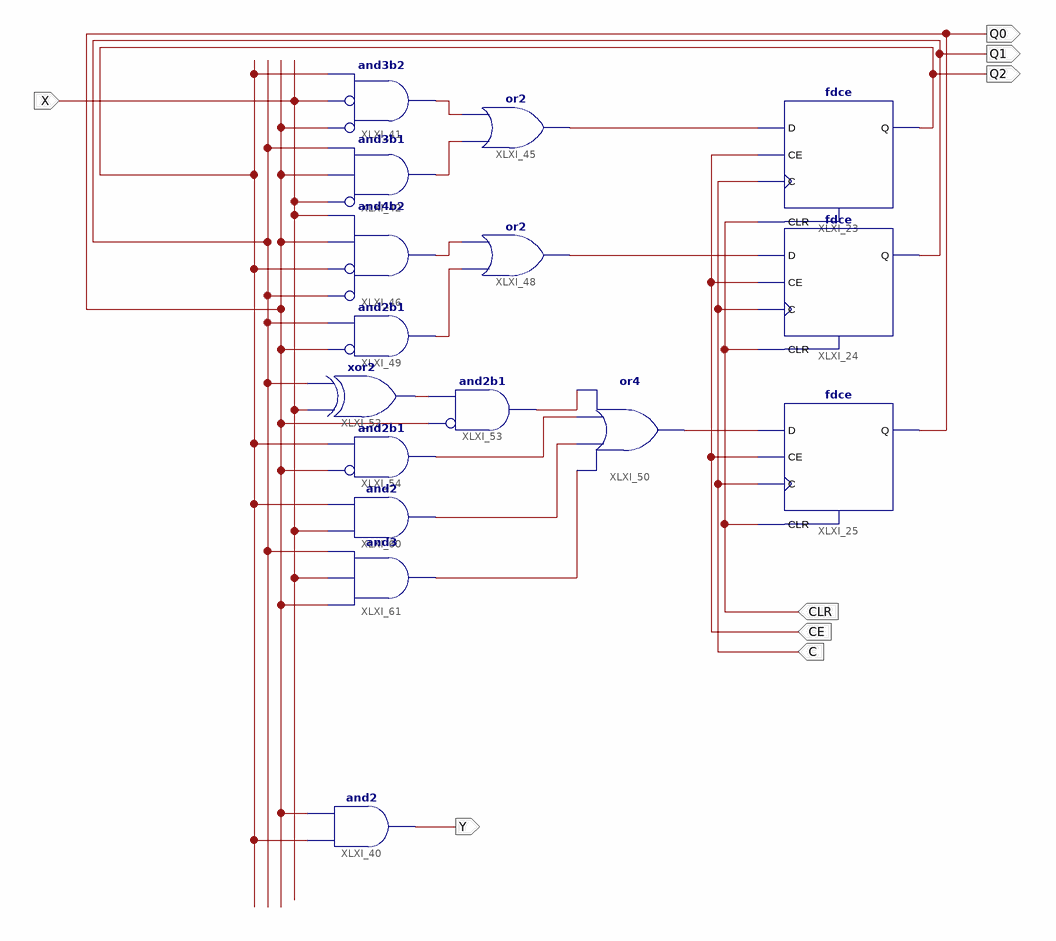
[diagram p0: schematic sheet 1]
// Xilinx ISE schematic lab4.sch (xc9500xl) as structural Verilog: 16 symbols, 8 ports
module lab4 (
  input  X,
  input  CLR,
  input  CE,
  input  C,
  output Q2,
  output Q0,
  output Q1,
  output Y
);

  wire XLXN_53, XLXN_54, XLXN_55, XLXN_100, XLXN_101, XLXN_102, XLXN_103, XLXN_104, XLXN_105, XLXN_116,
       XLXN_117, XLXN_118;

  fdce XLXI_23 (.C(C), .CE(CE), .CLR(CLR), .D(XLXN_53), .Q(Q2));
  fdce XLXI_24 (.C(C), .CE(CE), .CLR(CLR), .D(XLXN_54), .Q(Q1));
  fdce XLXI_25 (.C(C), .CE(CE), .CLR(CLR), .D(XLXN_55), .Q(Q0));
  and XLXI_41 (XLXN_100, ~Q0, ~X, Q2);  // and3b2
  and XLXI_42 (XLXN_101, ~X, Q0, Q1);  // and3b1
  or XLXI_45 (XLXN_53, XLXN_101, XLXN_100);
  and XLXI_46 (XLXN_102, ~Q1, ~Q2, Q0, X);  // and4b2
  or XLXI_48 (XLXN_54, XLXN_103, XLXN_102);
  and XLXI_49 (XLXN_103, ~Q0, Q1);  // and2b1
  or XLXI_50 (XLXN_55, XLXN_118, XLXN_117, XLXN_116, XLXN_105);
  xor XLXI_52 (XLXN_104, X, Q1);
  and XLXI_53 (XLXN_105, ~Q0, XLXN_104);  // and2b1
  and XLXI_54 (XLXN_116, ~Q0, Q2);  // and2b1
  and XLXI_40 (Y, Q2, Q0);
  and XLXI_60 (XLXN_117, X, Q2);
  and XLXI_61 (XLXN_118, Q0, X, Q1);
endmodule
